# Altium schematic sheet current_sensor_hall.SchDoc
size A4
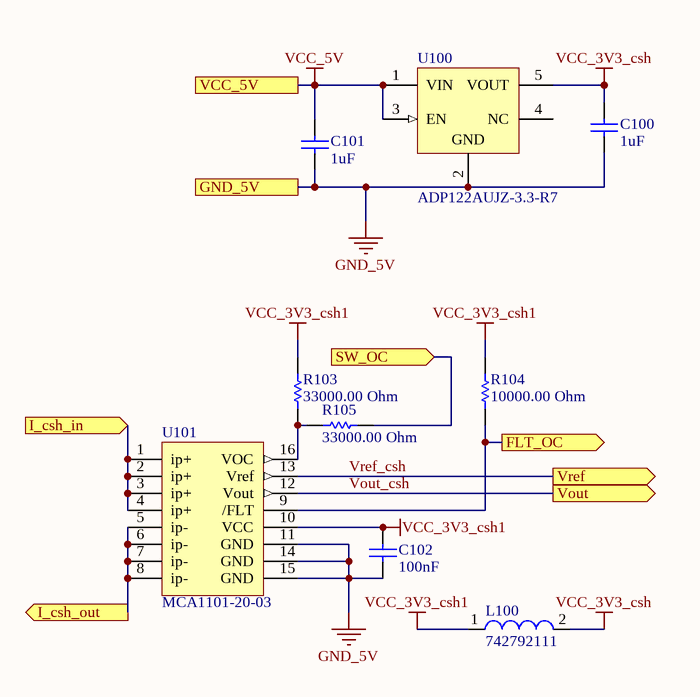
[diagram p0: current_sensor_hall.SchDoc]

## Parts
C100  value 1uF  [CAPC0603(1608)100_N]  (hidden comment: CAP 1uF 50V 0603(1608))
C101  value 1uF  [CAPC0603(1608)100_N]  (hidden comment: CAP 1uF 50V 0603(1608))
C102  value 100nF  [CAPC0603(1608)100_L]  (hidden comment: CAP 100nF 10V 0603(1608))
L100  742792111  [SMD-1206]
R103  value 33000.00 Ohm  [RESC0805(2012)_L]  (hidden comment: 33K 5% 0805(2012))
R104  value 10000.00 Ohm  [RESC0603(1608)_L]  (hidden comment: 10K 5% 0603(1608))
R105  value 33000.00 Ohm  [RESC0805(2012)_L]  (hidden comment: 33K 5% 0805(2012))
U100  ADP122AUJZ-3.3-R7  [ADI-UJ-5_L]
U101  MCA1101-20-03  [SOIC127P1030X265-16N]

## Ports
FLT_OC (out), GND_5V, I_csh_in (in), I_csh_out (out), SW_OC (in), VCC_5V, Vout (out), Vref (out)

## Nets
GND_5V: C100.1 C101.1 C102.1 U100.2(GND) U101.11(GND) U101.14(GND) U101.15(GND) ; port GND_5V
VCC_3V3_csh: C100.2 L100.2 U100.5(VOUT)
VCC_3V3_csh1: C102.2 L100.1 R103.2 R104.1 U101.10(VCC)
VCC_5V: C101.2 U100.1(VIN) U100.3(EN) ; port VCC_5V
FLT_OC: R104.2 U101.9(/FLT) ; port FLT_OC
I_csh_in: U101.1(ip+) U101.2(ip+) U101.3(ip+) U101.4(ip+) ; port I_csh_in
I_csh_out: U101.5(ip-) U101.6(ip-) U101.7(ip-) U101.8(ip-) ; port I_csh_out
SW_OC: R105.1 ; port SW_OC
Vout_csh: U101.12(Vout) ; port Vout
Vref_csh: U101.13(Vref) ; port Vref
NetR103_1: R103.1 R105.2 U101.16(VOC)

Not connected (* = marked no-connect by the designer): U100 4(NC)

## Library data of the parts
C100 C101 = CMP-1035-02746-1: CAP 1uF 50V ±20% 0603 (1608 Metric) Thickness 1mm SMD; Tolerance: Â±20%; Case-EIA: 0603; Case-Metric: 1608; Technology: SMT; Max Thickness: 1 mm; Rated Voltage: 50 V
C102 = CMP-1035-02580-1: CAP 100nF 10V ±10% 0603 (1608 Metric) Thickness 1mm SMD; Tolerance: Â±10%; Case-EIA: 0603; Case-Metric: 1608; Max Thickness: 1 mm; Rated Voltage: 10 V; Technology: SMT
L100 = CMP-0220-00024-1: SMD EMI Suppression Ferrite Bead WE-CBF, Z = 26 Ohm; Impedance: 26 Ohm; ComponentLink2Description: Datasheet; PackageReference: SMD-1206; ComponentLink2URL: http://www.we-online.de/katalog/media/pdf/742792111.pdf; PackageVersion: 2007; DatasheetVersion: Dec-2005; PackageDescription: Chip Inductor, 2-Leads, Body 3.2 x 1.6 mm; ComponentLink1URL: http://www.we-online.com; ComponentLink1Description: Manufacturer Link
R103 R105 = CMP-1013-00110-1: 33K 0.125W 5% 0805 (2012 Metric)  SMD; Case-EIA: 0805; Case-Metric: 2012; Power: 0.125 W; Tolerance: 5 %; Technology: SMT
R104 = CMP-1012-00098-1: 10K 0.1W 5% 0603 (1608 Metric)  SMD; Case-EIA: 0603; Case-Metric: 1608; Technology: SMT; Tolerance: 5 %; Power: 0.1 W
U100 = CMP-0786-00346-1: 300 mA, Low Quiescent Current, CMOS Linear Regulator, 2.3 to 5.5 V Vin, 3.3 V Vout, Industrial, 5-pin SOT23 (UJ-5), Reel; Manufacturer: Analog Devices; Vin (min) (V): 2.3; Supply Current IGND @ Small Load: 45uA; Vin (max) (V): 5.5; Iout max: 300mA; Preset Vout Values (V): 3.3; ComponentLink4Description: URL Link1; ComponentLink4URL: Product URL:http://www.analog.com/en/ADP122/productSearch.html; ComponentLink2URL: http://www.analog.com/static/imported-files/data_sheets/ADP122_123.pdf; PackageDescription: 5-Pin Thin Small Outline Transistor Package, Body 2.9 x 1.6 mm, Pitch 0.95 mm; ComponentLink1URL: http://www.analog.com/en/index.html; ComponentLink3URL: http:/www.analog.com/static/imported-files/packages/PKG_PDF/TSOT(UJ)/UJ_5.pdf; ComponentLink2Description: Datasheet; PartNumber: ADP122AUJZ-3.3-R7; Packing: Reel; ComponentLink1Description: Manufacturer URL; Code_JEDEC: MO-193-AB; PackageVersion: 100708-A, 10/2008; PackageReference: UJ-5; Mounting Technology: Surface Mount; DatasheetVersion: Rev. E; ComponentLink3Description: Package Specification
U101 = MCA1101-20-03: High Accuracy Current Sensor IC with 1.5MHz 3dB Bandwidth and Isolation ±20A,, 3.3V, Ratiometric; Manufacturer: ACEINNA; Mouser Part Number: 438-MCA1101-20-3; Mouser Price/Stock: https://www.mouser.com/Search/Refine.aspx?Keyword=438-MCA1101-20-3; Datasheet Link: https://www.mouser.cl/datasheet/2/940/6020-1104-01_B_Datasheet_2c_Current_Sensor_Fix_Gai-1622847.pdf; Current rating: 20A; Supply voltage: 3.3V; Package/Case: SOIC 16